# Altium schematic sheet 3V3_Buck_Regulator.SchDoc
size A4; SheetNumber: 4; SheetTotal: 5
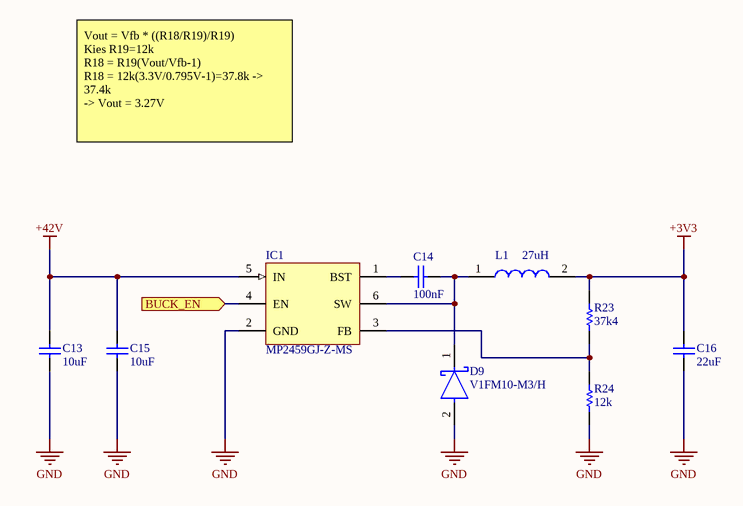
[diagram p0: 3V3_Buck_Regulator.SchDoc]

## Parts
C13  value 10uF  [Wurth 0805 capacitor]  (hidden comment: Generic Capacitor 10uF 0805)
C14  value 100nF  [Wurth 0603 capacitor]  (hidden comment: Generic Capacitor 100nF 0603)
C15  value 10uF  [Wurth 0805 capacitor]  (hidden comment: Generic Capacitor 10uF 0805)
C16  value 22uF  [Wurth 0805 capacitor]  (hidden comment: Generic Capacitor 22uF 0805)
D9  V1FM10-M3/H  [FP-V1FM10-M3-H-MFG]
IC1  MP2459GJ-Z-MS  [Texas InstrumentsSOT95P280X110-6N]
L1  value 27uH  [3L COILS 5.2X5.8MM]  (hidden comment: COILS SMTDR54-270M)
R23  value 37k4  [Wurth 0603 Resistor]  (hidden comment: Generic Resistor 37k4 0603)
R24  value 12k  [Wurth 0603 Resistor]  (hidden comment: Generic Resistor 12k 0603)

## Ports
BUCK_EN (in)

## Nets
+3V3: C16.2 L1.2 R23.2
+42V: C13.2 C15.2 IC1.5(IN)
GND: C13.1 C15.1 C16.1 D9.2(A) IC1.2(GND) R24.1
BUCK_EN: IC1.4(EN) ; port BUCK_EN
NetC14_1: C14.1 IC1.1(BST)
NetC14_2: C14.2 D9.1(C) IC1.6(SW) L1.1
NetIC1_3: IC1.3(FB) R23.1 R24.2

## Notes on the sheet
- Vout = Vfb * ((R18/R19)/R19)
  Kies R19=12k
  R18 = R19(Vout/Vfb-1)
  R18 = 12k(3.3V/0.795V-1)=37.8k -> 37.4k
  -> Vout = 3.27V

## Library data of the parts
D9 = CMP-02539-000045-1: 1A 100V SMF TRENCH SKY RECT; RoHS Compliant: Yes
IC1 = MSKSEMI MP2459GJ-Z-MS: Buck Converter 4.5V-60V 600mA
L1 = 3L COILS SMTDR54-270M inductor: Manufacturer: 3L Coils